# Altium project pir.PrjPcb
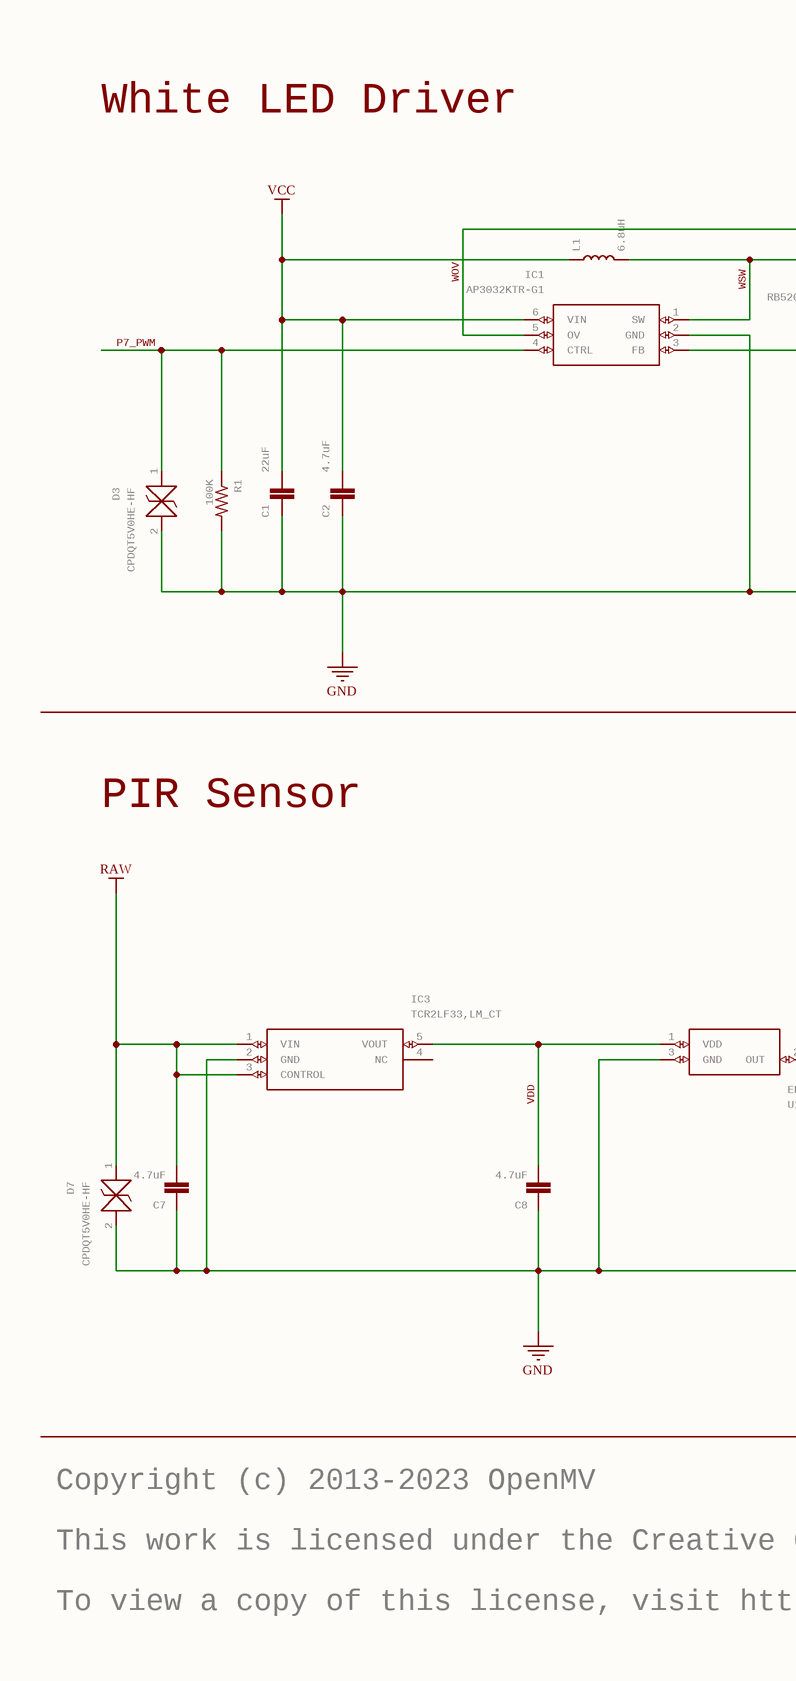
[diagram p0: pir.SchDoc, left]
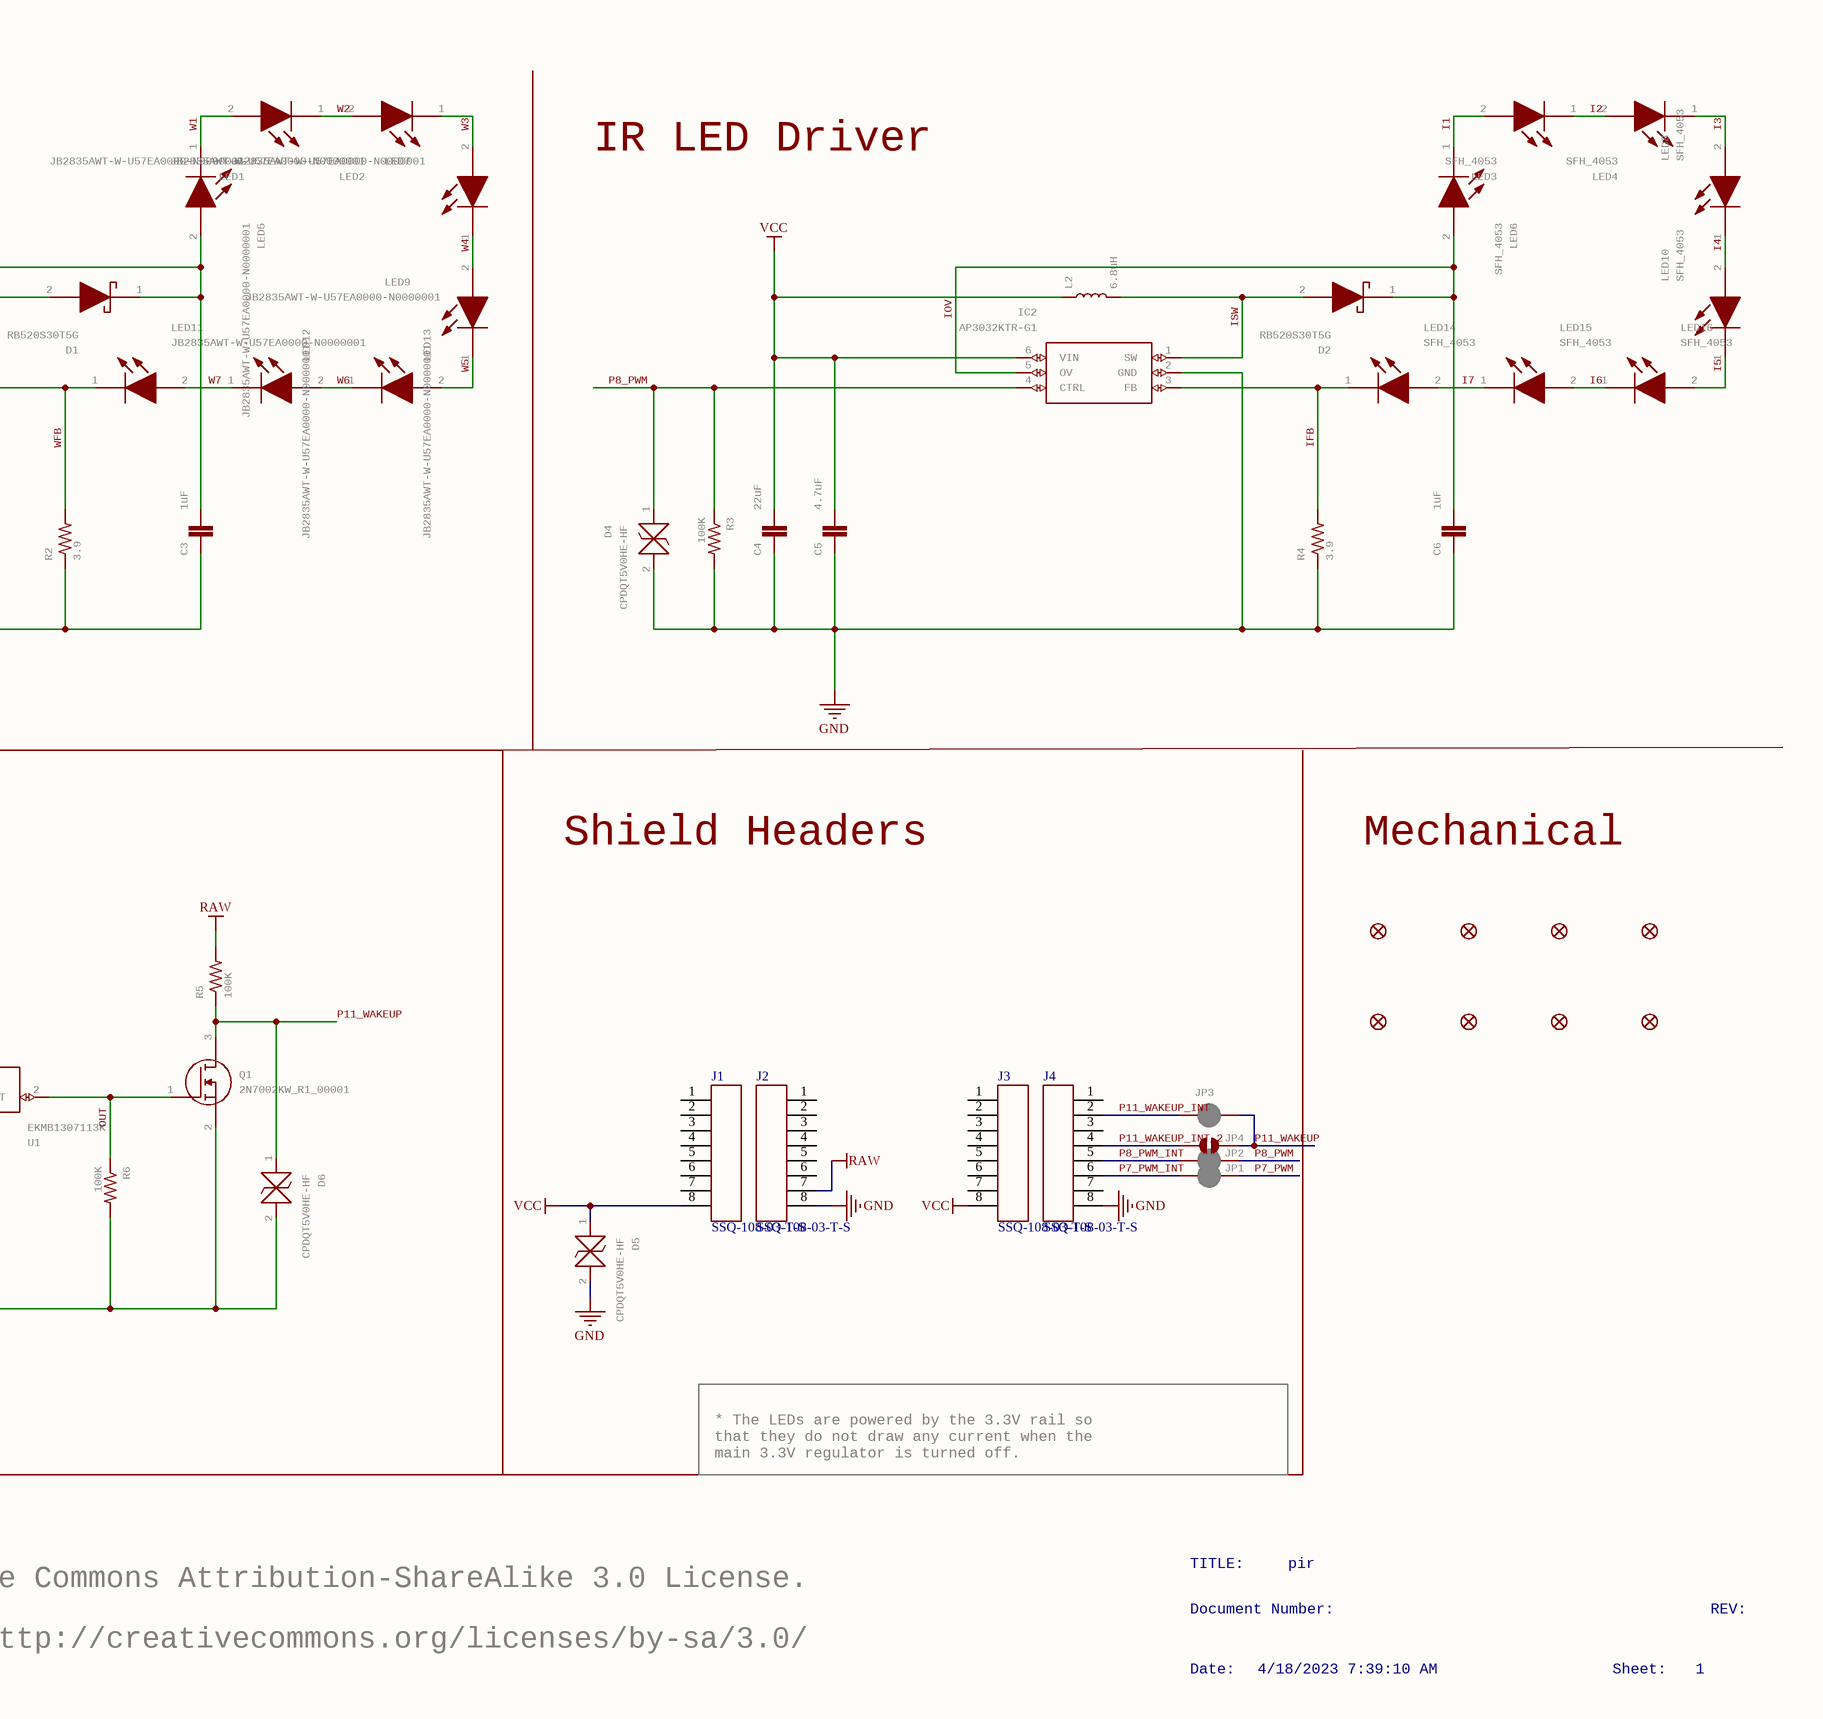
[diagram p1: pir.SchDoc, right]
1 sheet, 60 parts. Net scope: global (net labels, ports and power ports of the same name join across sheets).
Board file: pir.PcbDoc

## Sheet pir.SchDoc: pir
size 460 x 317 mm; Origin: Eagle; Date: 4/18/2023 7:39:10 AM; SheetNumber: 1; GateName_1: G$1; SymbolName_1: FRAME_B_L; LibraryName: frames; DeviceSetName: FRAME_B_L; GateName_2: G$2; SymbolName_2: DOCFIELD; Sheet: Sheet:; REV: REV:

### Parts
C1  22uF  [0805]
C2  4.7uF  [0402-CAP]
C3  1uF  [0402-CAP]
C4  22uF  [0805]
C5  4.7uF  [0402-CAP]
C6  1uF  [0402-CAP]
C7  4.7uF  [0402-CAP]
C8  4.7uF  [0402-CAP]
D1  RB520S30T5G  [SODFL1608X70N]
D2  RB520S30T5G  [SODFL1608X70N]
D3  CPDQT5V0HE-HF  [CPDQT5V0HEHF]
D4  CPDQT5V0HE-HF  [CPDQT5V0HEHF]
D5  CPDQT5V0HE-HF  [CPDQT5V0HEHF]
D6  CPDQT5V0HE-HF  [CPDQT5V0HEHF]
D7  CPDQT5V0HE-HF  [CPDQT5V0HEHF]
FD1  FIDUCIAL1X2  [FIDUCIAL-1X2]  (value not drawn)
FD2  FIDUCIAL1X2  [FIDUCIAL-1X2]  (value not drawn)
FD3  FIDUCIAL1X2  [FIDUCIAL-1X2]  (value not drawn)
FD4  FIDUCIAL1X2  [FIDUCIAL-1X2]  (value not drawn)
FD5  FIDUCIAL1X2  [FIDUCIAL-1X2]  (value not drawn)
FD6  FIDUCIAL1X2  [FIDUCIAL-1X2]  (value not drawn)
FD7  FIDUCIAL1X2  [FIDUCIAL-1X2]  (value not drawn)
FD8  FIDUCIAL1X2  [FIDUCIAL-1X2]  (value not drawn)
IC1  AP3032KTR-G1  [SOT95P280X145-6N]
IC2  AP3032KTR-G1  [SOT95P280X145-6N]
IC3  TCR2LF33,LM_CT  [TCR2LF33LMCT]
J1  SSQ-108-03-T-S  [HDR_1X8]
J2  SSQ-108-03-T-S  [HDR_1X8]
J3  SSQ-108-03-T-S  [HDR_1X8]
J4  SSQ-108-03-T-S  [HDR_1X8]
JP1  JUMPER-SMT_2_NC_PASTE_SILK  [SMT-JUMPER_2_NC_PASTE_SILK]  (value not drawn)
JP2  JUMPER-SMT_2_NC_PASTE_SILK  [SMT-JUMPER_2_NC_PASTE_SILK]  (value not drawn)
JP3  JUMPER-SMT_2_NC_PASTE_SILK  [SMT-JUMPER_2_NC_PASTE_SILK]  (value not drawn)
JP4  JUMPER-SMT_2_NO_SILK  [SMT-JUMPER_2_NO_SILK]  (value not drawn)
L1  6.8uH  [0805]
L2  6.8uH  [0805]
LED1  JB2835AWT-W-U57EA0000-N0000001  [JB2835AWTWU57EA0000N0000001]
LED2  JB2835AWT-W-U57EA0000-N0000001  [JB2835AWTWU57EA0000N0000001]
LED3  SFH_4053  [LEDC1005X55N]
LED4  SFH_4053  [LEDC1005X55N]
LED5  JB2835AWT-W-U57EA0000-N0000001  [JB2835AWTWU57EA0000N0000001]
LED6  SFH_4053  [LEDC1005X55N]
LED7  JB2835AWT-W-U57EA0000-N0000001  [JB2835AWTWU57EA0000N0000001]
LED8  SFH_4053  [LEDC1005X55N]
LED9  JB2835AWT-W-U57EA0000-N0000001  [JB2835AWTWU57EA0000N0000001]
LED10  SFH_4053  [LEDC1005X55N]
LED11  JB2835AWT-W-U57EA0000-N0000001  [JB2835AWTWU57EA0000N0000001]
LED12  JB2835AWT-W-U57EA0000-N0000001  [JB2835AWTWU57EA0000N0000001]
LED13  JB2835AWT-W-U57EA0000-N0000001  [JB2835AWTWU57EA0000N0000001]
LED14  SFH_4053  [LEDC1005X55N]
LED15  SFH_4053  [LEDC1005X55N]
LED16  SFH_4053  [LEDC1005X55N]
Q1  2N7002KW_R1_00001  [SOT65P210X110-3N]
R1  100K  [0402-RES]
R2  3.9  [R2512]
R3  100K  [0402-RES]
R4  3.9  [R2512]
R5  100K  [0402-RES]
R6  100K  [0402-RES]
U1  EKMB1307113K  [EKMB1304111K]

### Nets
GND: C1.1 C2.1 C3.1 C4.1 C5.1 C6.1 C7.1 C8.1 D3.2 D4.2 D5.2 D6.2 D7.2 IC1.2(GND) IC2.2(GND) IC3.2(GND) J2.8 J4.8 Q1.2(S) R1.2 R2.1 R3.2 R4.1 R6.2 U1.3(GND)
RAW: C7.2 D7.1 IC3.1(VIN) IC3.3(CONTROL) J2.7 R5.2
VCC: C1.2 C2.2 C4.2 C5.2 D5.1 IC1.6(VIN) IC2.6(VIN) J1.8 J3.8 L1.1 L2.1
I1: LED3.2(A) LED6.1(K)
I2: LED3.1(K) LED4.2(A)
I3: LED4.1(K) LED8.2(A)
I4: LED8.1(K) LED10.2(A)
I5: LED10.1(K) LED16.2(A)
I6: LED15.2(A) LED16.1(K)
I7: LED14.2(A) LED15.1(K)
IFB: IC2.3(FB) LED14.1(K) R4.2
IOV: C6.2 D2.1(K) IC2.5(OV) LED6.2(A)
ISW: D2.2(A) IC2.1(SW) L2.2
OUT: Q1.1(G) R6.1 U1.2(OUT)
P7_PWM: D3.1 IC1.4(CTRL) JP1.2 R1.1
P7_PWM_INT: J4.6 JP1.1
P8_PWM: D4.1 IC2.4(CTRL) JP2.2 R3.1
P8_PWM_INT: J4.5 JP2.1
P11_WAKEUP: D6.1 JP3.2 JP4.2 Q1.3(D) R5.1
P11_WAKEUP_INT: J4.2 JP3.1
P11_WAKEUP_INT_2: J4.4 JP4.1
VDD: C8.2 IC3.5(VOUT) U1.1(VDD)
W1: LED1.2(A) LED5.1(K)
W2: LED1.1(K) LED2.2(A)
W3: LED2.1(K) LED7.2(A)
W4: LED7.1(K) LED9.2(A)
W5: LED9.1(K) LED13.2(A)
W6: LED12.2(A) LED13.1(K)
W7: LED11.2(A) LED12.1(K)
WFB: IC1.3(FB) LED11.1(K) R2.2
WOV: C3.2 D1.1(K) IC1.5(OV) LED5.2(A)
WSW: D1.2(A) IC1.1(SW) L1.2

Not connected (* = marked no-connect by the designer): IC3 4(NC); J1 1 2 3 4 5 6 7; J2 1 2 3 4 5 6; J3 1 2 3 4 5 6 7; J4 1 3 7

### Notes on the sheet
- White LED Driver
- IR LED Driver
- PIR Sensor
- Shield Headers
- Mechanical
- * The LEDs are powered by the 3.3V rail so
  that they do not draw any current when the
  main 3.3V regulator is turned off.
- Copyright (c) 2013-2023 OpenMV
- TITLE:
- pir
- This work is licensed under the Creative Commons Attribution-ShareAlike 3.0 License.
- To view a copy of this license, visit http://creativecommons.org/licenses/by-sa/3.0/
- Document Number:
- REV:
- Date:
- 4/18/2023 7:39:10 AM
- Sheet:
- 1

### Library data of the parts
C1 C4 = 22UF-0805-6.3V-20%: 22ÂµF ceramic capacitors    A capacitor is a passive two-terminal electrical component used to store electrical energy temporarily in an electric field.; MPN: CL21A226MQQNNNE; GateName_1: G$1; SymbolName_1: CAP; PROD_ID: CAP-08402; DeviceName: -0805-6.3V-20%; LibraryName: SparkFun-Capacitors; DeviceSetName: 22UF
C2 C5 C7 C8 = CAP0402-CAP: CapacitorStandard 0603 ceramic capacitor, and 0.1" leaded capacitor.; MPN: JMK105BBJ475MV-F; GateName_1: G$1; SymbolName_1: CAP; DeviceName: 0402-CAP; LibraryName: sfe; DeviceSetName: CAP
C3 C6 = CAP0402-CAP: CapacitorStandard 0603 ceramic capacitor, and 0.1" leaded capacitor.; MPN: GRM155R6YA105KE11D; GateName_1: G$1; SymbolName_1: CAP; DeviceName: 0402-CAP; LibraryName: sfe; DeviceSetName: CAP
D1 D2 = RB520S30T5G: Diode Schottky 30V 0.2A Automotive 2-Pin SOD-523 T/R   Source:  Datasheet; MANUFACTURER_NAME: onsemi; GateName_1: G$1; SymbolName_1: RB520S30T5G; LibraryName: RB520S30T5G; DeviceSetName: RB520S30T5G; HEIGHT: 0.7mm; MANUFACTURER_PART_NUMBER: RB520S30T5G; MOUSER_PART_NUMBER: 863-RB520S30T5G; MOUSER_PRICE-STOCK: https://www.mouser.co.uk/ProductDetail/onsemi/RB520S30T5G?qs=M3GgpExcU29g6z8VWjIiaA%3D%3D; MPN: RB520S30T5G
D3-D7 = CPDQT5V0HE-HF: ESD Suppressors / TVS Diodes DIODE ESD 5VWM 65W 0402/SOD-923F   Source:  Datasheet; MANUFACTURER_NAME: Comchip Technology; GateName_1: G$1; SymbolName_1: CPDQT5V0HE-HF; LibraryName: CPDQT5V0HE-HF; DeviceSetName: CPDQT5V0HE-HF; HEIGHT: 0.42mm; MANUFACTURER_PART_NUMBER: CPDQT5V0HE-HF; MOUSER_PART_NUMBER: MOUSER_PART_NUMBER; MOUSER_PRICE-STOCK: MOUSER_PRICE-STOCK; MPN: CPDQT5V0HE-HF
FD1-FD8 = FIDUCIAL1X2: Fiducial Alignment Points    Point-of-reference for pick-and-place machines and other optical instruments.; GateName_1: G$1; DeviceName: 1X2; SymbolName_1: FIDUCIAL; LibraryName: SparkFun-Aesthetics; DeviceSetName: FIDUCIAL
IC1 IC2 = AP3032KTR-G1: DiodesZetex AP3032KTR-G1, Step Up DC-DC Converter, Adjustable, Maximum of 38 V, 6-Pin SOT-23   Source:  Datasheet; MANUFACTURER_NAME: Diodes Inc.; GateName_1: G$1; SymbolName_1: AP3032KTR-G1; LibraryName: AP3032KTR-G1; DeviceSetName: AP3032KTR-G1; HEIGHT: 1.45mm; MANUFACTURER_PART_NUMBER: AP3032KTR-G1; MOUSER_PART_NUMBER: 621-AP3032KTR-G1; MOUSER_PRICE-STOCK: https://www.mouser.co.uk/ProductDetail/Diodes-Incorporated/AP3032KTR-G1?qs=x6A8l6qLYDBKP%252BiASla%2FZw%3D%3D; MPN: AP3032KTR-G1
IC3 = TCR2LF33,LM_CT: Linear Voltage Regulator IC Positive Fixed 1 Output 200mA SMV   Source:  Datasheet; MANUFACTURER_NAME: Toshiba; MANUFACTURER_PART_NUMBER: TCR2LF33,LM(CT; GateName_1: G$1; SymbolName_1: TCR2LF33,LM_CT; LibraryName: TCR2LF33_LM_CT; DeviceSetName: TCR2LF33,LM_CT; HEIGHT: 1.4mm; MOUSER_PART_NUMBER: 757-TCR2LF33LMCT; MOUSER_PRICE-STOCK: https://www.mouser.co.uk/ProductDetail/Toshiba/TCR2LF33LMCT?qs=lX6dEUlT%252BgfjY8NAoxAO5A%3D%3D; MPN: TCR2LF33,LM(CT
J1-J4 = HDR_1X8: MANUFACTURER P/N: SSQ-108-03-T-S
JP1-JP3 = JUMPER-SMT_2_NC_PASTE_SILK: Normally closed solder jumper    This jumper has an aperture in the stencil to allow solder paste to bridge the split in the wire so it's normally closed (NC). Wick off the solder to open the connection. Reapply solder to reclose the connection.; GateName_1: G$1; SymbolName_1: SMT-JUMPER_2_NC_PASTE; DeviceName: _SILK; LibraryName: SparkFun-Jumpers; DeviceSetName: JUMPER-SMT_2_NC_PASTE
JP4 = JUMPER-SMT_2_NO_SILK: Normally open jumper    This jumper has two pads in close proximity to each other. Apply solder to close the connection.   Round pads are easier to solder for beginners, but are a lot larger.   SparkFun Product that uses the round pads:  SparkFun EL Sequencer; GateName_1: G$1; SymbolName_1: SMT-JUMPER_2_NO; DeviceName: _SILK; LibraryName: SparkFun-Jumpers; DeviceSetName: JUMPER-SMT_2_NO
L1 L2 = INDUCTOR-0805-3.3UH: Inductors    Resist changes in electrical current. Basically a coil of wire.   SparkFun Products:  SparkFun Load Cell Amplifier - HX711  IOIO-OTG - V2.2; MPN: MLZ2012M6R8WT000; GateName_1: G$1; PROD_ID: NDUC-13076; SymbolName_1: INDUCTOR; DeviceName: -0805-3.3UH; LibraryName: SparkFun-Coils; DeviceSetName: INDUCTOR
LED1 LED2 LED5 LED7 LED9 LED11-LED13 = JB2835AWT-W-U57EA0000-N0000001: Mid-Power LEDs - White White 5700 K 90-CRI, 2835 Size, W Class   Source:  Datasheet; MANUFACTURER_NAME: Wolfspeed; GateName_1: G$1; SymbolName_1: JB2835AWT-W-U57EA0000-N0000001; LibraryName: JB2835AWT-W-U57EA0000-N0000001; DeviceSetName: JB2835AWT-W-U57EA0000-N0000001; HEIGHT: 0.8mm; MANUFACTURER_PART_NUMBER: JB2835AWT-W-U57EA0000-N0000001; MOUSER_PART_NUMBER: 941-JB2835AWTU57EAN; MOUSER_PRICE-STOCK: https://www.mouser.co.uk/ProductDetail/Cree-LED/JB2835AWT-W-U57EA0000-N0000001?qs=7MVldsJ5UaxVpdW62VaK8g%3D%3D; MPN: JB2835AWT-W-U57EA0000-N0000001
LED3 LED4 LED6 LED8 LED10 LED14-LED16 = SFH_4053: IR Emitter,High Power,CHIPLED,850nm,140d Osram Opto SFH 4053 CHIPLED IR LED, 860nm, 0402 SMD package   Source:  Datasheet; GateName_1: G$1; SymbolName_1: SFH_4053; LibraryName: SFH_4053; DeviceSetName: SFH_4053; HEIGHT: 0.55mm; MANUFACTURER_NAME: OSRAM; MANUFACTURER_PART_NUMBER: SFH 4053; MOUSER_PART_NUMBER: 720-SFH4053; MOUSER_PRICE-STOCK: https://www.mouser.co.uk/ProductDetail/OSRAM-Opto-Semiconductors/SFH-4053?qs=WFZtTl33IYKBVpRycaqUAw%3D%3D; MPN: SFH 4053
Q1 = 2N7002KW_R1_00001: MOSFET 60V N-Channel Enhancement Mode MOSFET - ESD Protected   Source:  Datasheet; MANUFACTURER_NAME: PANJIT; GateName_1: G$1; SymbolName_1: 2N7002KW_R1_00001; LibraryName: 2N7002KW_R1_00001; DeviceSetName: 2N7002KW_R1_00001; HEIGHT: 1.1mm; MANUFACTURER_PART_NUMBER: 2N7002KW_R1_00001; MOUSER_PART_NUMBER: 241-2N7002KWR100001; MOUSER_PRICE-STOCK: https://www.mouser.co.uk/ProductDetail/Panjit/2N7002KW_R1_00001?qs=sPbYRqrBIVliWKATqv7jNA%3D%3D; MPN: 2N7002KW_R1_00001
R1 R3 R5 R6 = RESISTOR0402-RES: ResistorBasic schematic elements and footprints for 0603, 1206, and PTH resistors.; MPN: AC0402FR-07100KL; GateName_1: G$1; SymbolName_1: RESISTOR; DeviceName: 0402-RES; LibraryName: sfe; DeviceSetName: RESISTOR
R2 R4 = R-US_R2512: RESISTOR, American symbol; MPN: 35203R9JT; GateName_1: G$1; SymbolName_1: R-US; DeviceSetName: R-US_; POPULARITY: 0; DeviceName: R2512; LibraryName: rcl; SPICEPREFIX: R
U1 = EKMB1304111K: Sensor PIR (Passive Infrared) 472" (12m) 39.4'  Module   Source:  Datasheet; MANUFACTURER_NAME: Panasonic; GateName_1: G$1; SymbolName_1: EKMB1304111K; LibraryName: EKMB1304111K; DeviceSetName: EKMB1304111K; HEIGHT: 20.7mm; MANUFACTURER_PART_NUMBER: EKMB1304111K; MOUSER_PART_NUMBER: 769-EKMB1304111K; MOUSER_PRICE-STOCK: https://www.mouser.co.uk/ProductDetail/Panasonic-Industrial-Devices/EKMB1304111K?qs=gtWD0wcPNfNnxnKOQp2%252BgA%3D%3D; MPN: EKMB1307113K